# Altium schematic sheet BUCK_SCHEM.SchDoc
size A; SheetNumber: 1; SheetTotal: 1
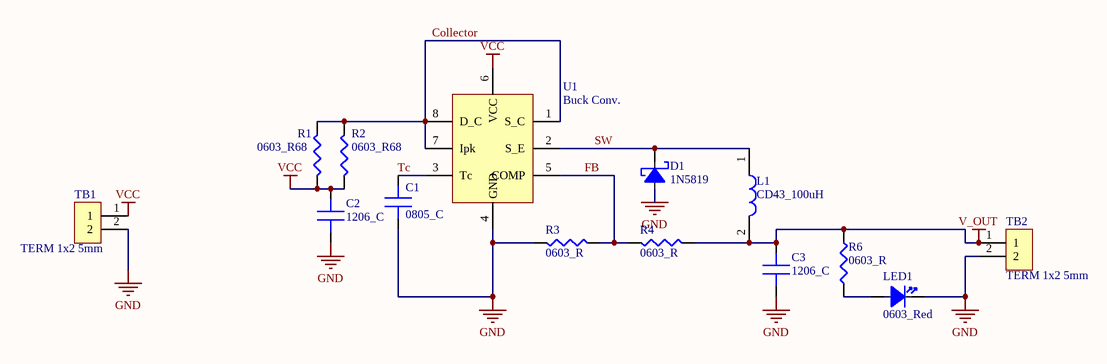
[diagram p0: BUCK_SCHEM.SchDoc]

## Parts
C1  0805_C  [C0805 - 0.1uf]
C2  1206_C  [1206]
C3  1206_C  [1206]
D1  1N5819  [D0-214AC]
L1  CD43_100uH  [CD43]
LED1  0603_Red  [0603_LED]
R1  0603_R68  [0603_CAP]
R2  0603_R68  [0603_CAP]
R3  0603_R  [0603_CAP]
R4  0603_R  [0603_CAP]
R6  0603_R  [0603_CAP]
TB1  TERM 1x2 5mm  [Terminal_5mm]
TB2  TERM 1x2 5mm  [Terminal_5mm]
U1  Buck Conv.  [SOP8]

## Nets
GND: C1.1 C2.1 C3.1 D1.A(Anode) LED1.2(Cathode) R3.1 TB1.2 TB2.2 U1.4(GND)
V_OUT: C3.2 L1.2 R4.2 R6.2 TB2.1
VCC: C2.2 R1.1 R2.1 TB1.1 U1.6(VCC)
Collector: R1.2 R2.2 U1.1(S_C) U1.7(Ipk) U1.8(D_C)
FB: R3.2 R4.1 U1.5(COMP)
SW: D1.K(Cathode) L1.1 U1.2(S_E)
Tc: C1.2 U1.3(Tc)
NetLED1_1: LED1.1(Anode) R6.1

## Library data of the parts
C1 = 0805 Capacitor
C2 C3 = 1206 Capacitor
D1 = 1N5819: 1N5819 SS14 SMA Schottky Barrier Diodes (SBD) 40V 550mV@1A 1A
L1 = 100uH 4.5x4x3.2mm
LED1 = 0603LED
R1-R4 R6 = 0603 Resistor
TB1 TB2 = Terminal BLK Green: PHOENIX CONTACT         MKDSN 1,5/ 2             Wire-To-Board Terminal Block, 5 mm, 2 Ways, 26 AWG, 16 AWG, 1.5 mm, Screw; Manufacturer Part Number 1: 1729018; Parameter Name 1: Bulk; Number of Positions: 2; Current Rating: 13.5A; Number of Levels: 1; Current: 10A; Gender: Male; Voltage Rating: 400V; Voltage: 300V; Max Supply Voltage: 250V; Wire Gauge (Max): 26AWG; Stripping Length: 6mm; Approvals: UL,CSA,cULus,CB; Supplier 1: Mouser; Manufacturer 1: Phoenix Contact; Stock 1: 6371; Pricing 1: 1=1.10000, 10=1.05000, 50=1.01000, 100=0.97400, 250=0.91000, 500=0.83800 (USD); RoHS: Yes; Mount: Through Hole; Number of Pins: 2; Weight: 0.06949oz; Color: Green; Material: Polyamide; Housing Material: Polyamide; Housing Color: Green; Contact Material: Tin; Insulation Material: Nylon; Package Quantity: 50; Termination: Screw; Number of Positions Per Level: 2; Number of Contacts: 2; Number of Circuits: 2; Connector Type: Screw; Orientation: Straight; Number of Rows: 1; Max Current Rating: 13.5A; Number of Poles: 2; Length: 8.1mm; Height: 13.5mm; Pitch: 5mm; Wire Gauge (Min): 26AWG; Depth: 8.1mm; Width: 13.5mm; Wire/Cable Gauge: 26AWG; Radiation Hardening: No; REACH SVHC: Unknown; Flammability Rating: UL94 V-0; Lead Free: Lead Free; ComponentLink1URL: https://datasheet.ciiva.com/16071/1729018-16071814.pdf?src-supplier=Onlinecomponents.com; ComponentLink1Description: https://datasheet.ciiva.com/16071/1729018-16071814.pdf?src-supplier=Onlinecomponents.com; ComponentLink2URL: https://datasheet.ciiva.com/832/1729018-832055.pdf?src-supplier=Digi-Key; ComponentLink2Description: https://datasheet.ciiva.com/832/1729018-832055.pdf?src-supplier=Digi-Key; ComponentLink3URL: https://datasheet.ciiva.com/15169/getdatasheetpartid-177860-15169643.pdf?src-supplier=Verical; ComponentLink3Description: https://datasheet.ciiva.com/15169/getdatasheetpartid-177860-15169643.pdf?src-supplier=Verical; ComponentLink4URL: https://datasheet.ciiva.com/14607/70054375-14607356.pdf?src-supplier=Allied+Electronics; ComponentLink4Description: https://datasheet.ciiva.com/14607/70054375-14607356.pdf?src-supplier=Allied+Electronics; ComponentLink5URL: https://datasheet.ciiva.com/33105/1729018-33105978.pdf?src-supplier=Today+Components; ComponentLink5Description: https://datasheet.ciiva.com/33105/1729018-33105978.pdf?src-supplier=Today+Components; Supplier Part Number 1: 651-1729018
U1 = MC33063A